# EAGLE schematic Schematic (EAGLE 9.6.2)
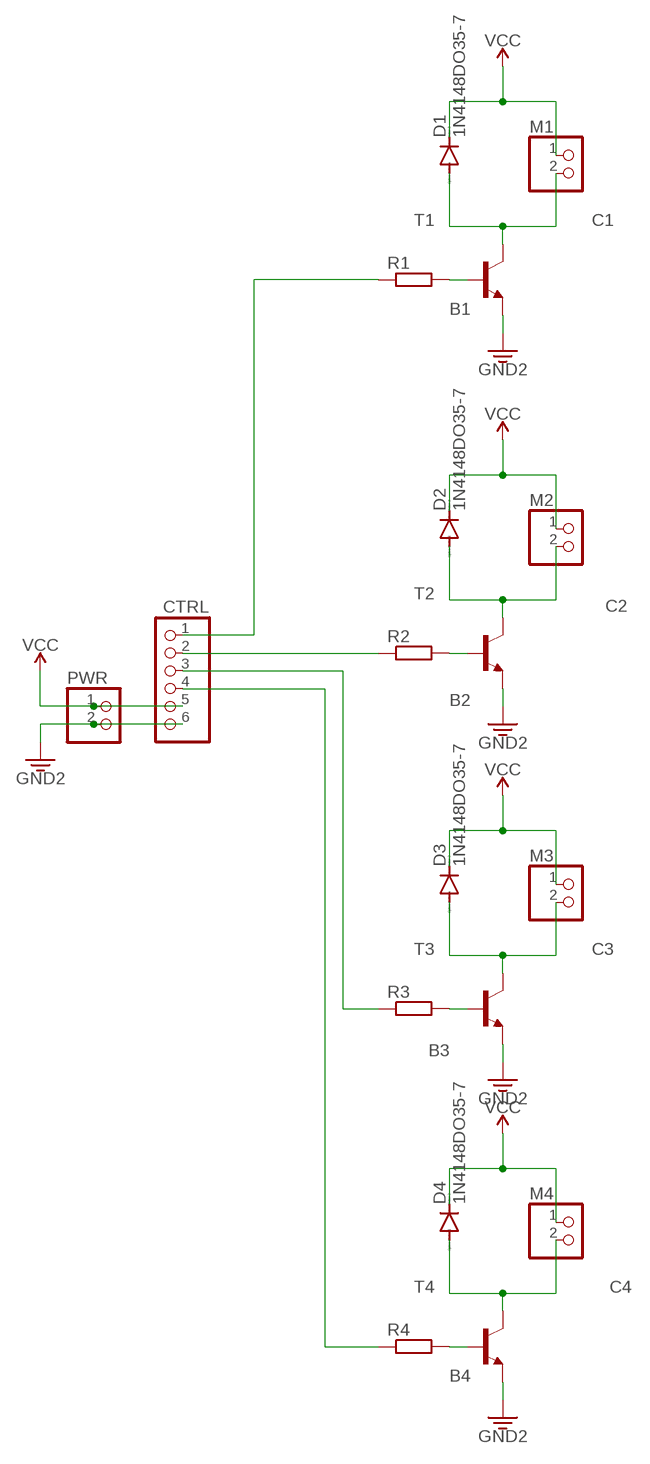
[diagram p0: schematic, sheet 1]

## Parts
CTRL  PINHD-1X6  [1X06]
D1  1N4148DO35-7  [DO35-7]
D2  1N4148DO35-7  [DO35-7]
D3  1N4148DO35-7  [DO35-7]
D4  1N4148DO35-7  [DO35-7]
M1  PINHD-1X2  [1X02]
M2  PINHD-1X2  [1X02]
M3  PINHD-1X2  [1X02]
M4  PINHD-1X2  [1X02]
PWR  PINHD-1X2  [1X02]
R1  R-EU_R0805  [R0805]
R2  R-EU_R0805  [R0805]
R3  R-EU_R0805  [R0805]
R4  R-EU_R0805  [R0805]
T1  2N2222-NPN-TO92-EBC  [TO92-EBC]
T2  2N2222-NPN-TO92-EBC  [TO92-EBC]
T3  2N2222-NPN-TO92-EBC  [TO92-EBC]
T4  2N2222-NPN-TO92-EBC  [TO92-EBC]

## Nets
3.3V: CTRL.6 PWR.2 T1.E T2.E T3.E T4.E ; supply symbol labelled GND2
B1: R1.2 T1.B
B2: R2.2 T2.B
B3: R3.2 T3.B
B4: R4.2 T4.B
C1: D1.A M1.2 T1.C
C2: D2.A M2.2 T2.C
C3: D3.A M3.2 T3.C
C4: D4.A M4.2 T4.C
N$9: CTRL.1 R1.1
N$10: CTRL.2 R2.1
N$11: CTRL.3 R3.1
N$12: CTRL.4 R4.1
VCC: CTRL.5 D1.C D2.C D3.C D4.C M1.1 M2.1 M3.1 M4.1 PWR.1

## Library data of the parts
CTRL = pinhead:PINHD-1X6: PIN HEADER
D1-D4 = diode:1N4148: DIODE high speed (Philips)
M1-M4 PWR = pinhead:PINHD-1X2: PIN HEADER
R1-R4 = rcl:R-EU_: RESISTOR, European symbol; SPICEPREFIX: R
T1-T4 = transistor-neu-to92:*-NPN-: NPN Transistror